# Altium schematic sheet RF_Transmit.SchDoc
size A4; DocumentNumber: 28; SheetNumber: 28; SheetTotal: 47
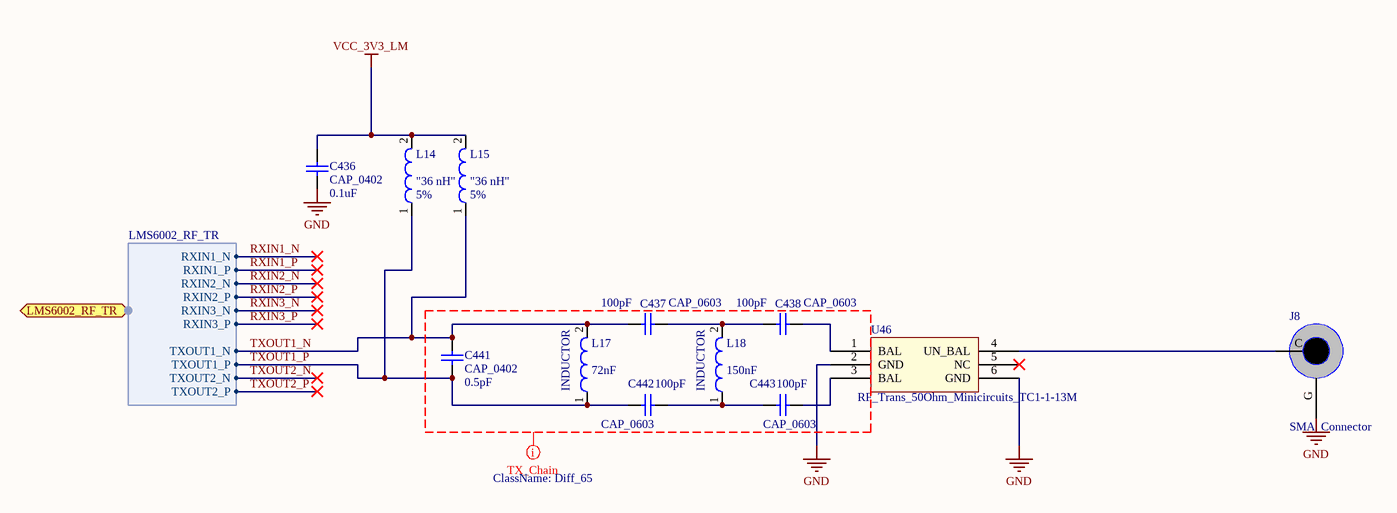
[diagram p0: RF_Transmit.SchDoc]

## Parts
C436  CAP_0402  value 0.1uF  [CAPC0402(1005)60_N]
C437  CAP_0603  value 100pF  [CAPC0603(1608)100_N]
C438  CAP_0603  value 100pF  [CAPC0603(1608)100_N]
C441  CAP_0402  value 0.5pF  [CAPC0402(1005)60_N]
C442  CAP_0603  value 100pF  [CAPC0603(1608)100_N]
C443  CAP_0603  value 100pF  [CAPC0603(1608)100_N]
J8  SMA_Connector  [Connector_SMA_Amphenol_132255_Edgemount]
L14  value "36 nH"  Tolerance: 5%  [Inductor0402(1005)]  (hidden comment: INDUCTOR)
L15  value "36 nH"  Tolerance: 5%  [Inductor0402(1005)]  (hidden comment: INDUCTOR)
L17  INDUCTOR  value 72nF  [Inductor0603(1608)]
L18  INDUCTOR  value 150nF  [Inductor0603(1608)]
U46  RF_Trans_50Ohm_Minicircuits_TC1-1-13M  [RF_Trans_50Ohm_Minicircuits_TC1-1-13M_AT224]

## Ports
LMS6002_RF_TR (harness LMS6002_RF_TR)

## Harnesses
LMS6002_RF_TR: RXIN1_N, RXIN1_P, RXIN2_N, RXIN2_P, RXIN3_N, RXIN3_P, TXOUT1_N, TXOUT1_P, TXOUT2_N, TXOUT2_P

## Nets
GND: C436.1 J8.G U46.2(GND) U46.6(GND)
VCC_3V3_LM: C436.2 L14.2 L15.2
RXIN1_N: port LMS6002_RF_TR.RXIN1_N
RXIN1_P: port LMS6002_RF_TR.RXIN1_P
RXIN2_N: port LMS6002_RF_TR.RXIN2_N
RXIN2_P: port LMS6002_RF_TR.RXIN2_P
RXIN3_N: port LMS6002_RF_TR.RXIN3_N
RXIN3_P: port LMS6002_RF_TR.RXIN3_P
TXOUT1_N: C437.1 C441.2 L15.1 L17.2 ; port LMS6002_RF_TR.TXOUT1_N
TXOUT1_P: C441.1 C442.1 L14.1 L17.1 ; port LMS6002_RF_TR.TXOUT1_P
TXOUT2_N: port LMS6002_RF_TR.TXOUT2_N
TXOUT2_P: port LMS6002_RF_TR.TXOUT2_P
NetC437_2: C437.2 C438.1 L18.2
NetC438_2: C438.2 U46.1(BAL)
NetC442_2: C442.2 C443.1 L18.1
NetC443_2: C443.2 U46.3(BAL)
NetJ8_C: J8.C U46.4(UN_BAL)

Not connected (* = marked no-connect by the designer): U46 5(NC)*

## Layout directives
net class Diff_65: (no net found under the mark)

## Library data of the parts
C436 = C1005X5R0J104K: 0.1uf, ceramic, 10%, 6.3V, X5R, 0402; Manufacturer: TDK Corporation; Tolerance: 10%; Part Number: C1005X5R0J104K
C437 C438 C442 C443 = VJ0603D101JXCAJ: CAP CER 100PF 200V 5% NP0 0603; Manufacturer: Vishay Vitramon; Tolerance: 5%; Part Number: VJ0603D101JXCAJ
C441 = C0402C508D3GACTU: CAP CER 0.5PF 25V NP0 0402; Manufacturer: Kemet; Part Number: C0402C508D3GACTU
J8 = 132255: CONN RCPT SMA END LAUNCH PCB; Part Number: 132255; Manufacturer: Amphenol Connex
L14 L15 = "0402CS-36NX_L": Inductor 36 nH 0402 5%; Manufacturer: Coilcraft; Part Number: "0402CS-36NX_L"; Library Ref: INDUCTOR; Footprint Ref: Inductor0402(1005)
L17 = 0603LS-72NXGLB: INDUCTOR, 72nF, 2%, 1.4A, 0603; Manufacturer: Coilcraft; Tolerance: 2%; Part Number: 0603LS-72NXGLB
L18 = 0603LS-151XGLB: INDUCTOR, 150nF, 2%, 1.4A, 0603; Manufacturer: Coilcraft; Tolerance: 2%; Part Number: 0603LS-151XGLB
U46 = TC1-1-13M: RF Transformer, 50 Ohm, 4.5 to 3000 MHz, Leadless Surface Mount, AT224; Part Number: TC1-1-13M; Manufacturer: Minicircuits